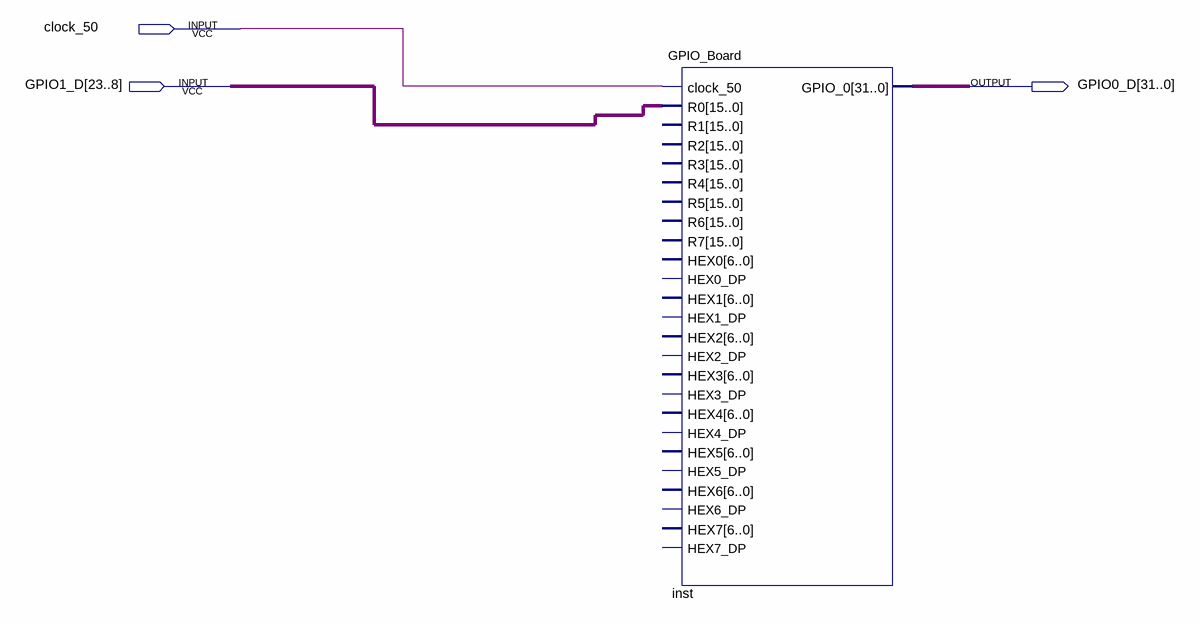
[diagram p0: schematic sheet]
// Quartus schematic SwitchTest.bdf as structural Verilog: 1 symbols, 3 pins
module SwitchTest (
  input  clock_50,
  input  [23:8] GPIO1_D,
  output [31:0] GPIO0_D
);

  GPIO_Board inst (
    .clock_50(clock_50), .R0(GPIO1_D), .GPIO_0(GPIO0_D));  // open: R1, R2, R3, R4, R5, R6, R7, HEX0, HEX0_DP, HEX1, HEX1_DP, HEX2, HEX2_DP, HEX3, HEX3_DP, HEX4, HEX4_DP, HEX5, HEX5_DP, HEX6, HEX6_DP, HEX7, HEX7_DP
endmodule
